# Altium schematic sheet Dragonfleye.SchDoc
size A; DocumentNumber: 1; SheetNumber: 1
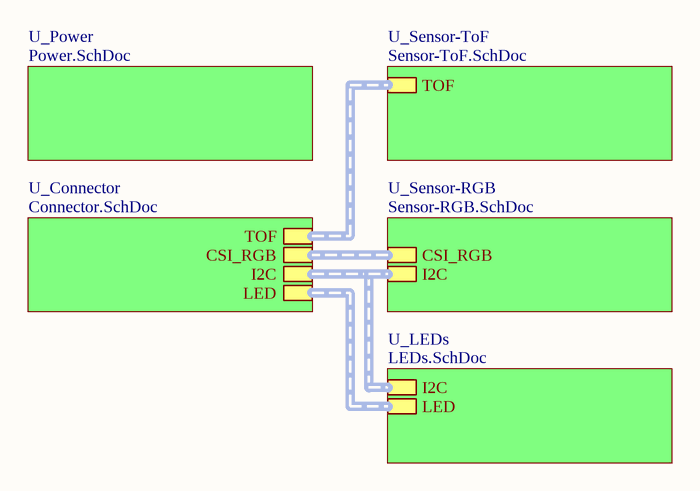
[diagram p0: Dragonfleye.SchDoc]

## Sub-sheets
U_Connector = Connector.SchDoc: I2C (harness I2C), TOF (harness TOF), LED (harness LED), CSI_RGB (harness CSI)
U_LEDs = LEDs.SchDoc: LED (harness LED), I2C (harness I2C)
U_Power = Power.SchDoc: no entries
U_Sensor-RGB = Sensor-RGB.SchDoc: CSI_RGB (harness CSI), I2C (harness I2C)
U_Sensor-ToF = Sensor-ToF.SchDoc: TOF (harness TOF)

## Buses and harness runs
harness sheet U_Connector/CSI_RGB = sheet U_Sensor-RGB/CSI_RGB
harness sheet U_Connector/I2C = sheet U_LEDs/I2C = sheet U_Sensor-RGB/I2C
harness sheet U_Connector/LED = sheet U_LEDs/LED
harness sheet U_Connector/TOF = sheet U_Sensor-ToF/TOF